# EAGLE design tira rev4 (EAGLE 8.5.1)
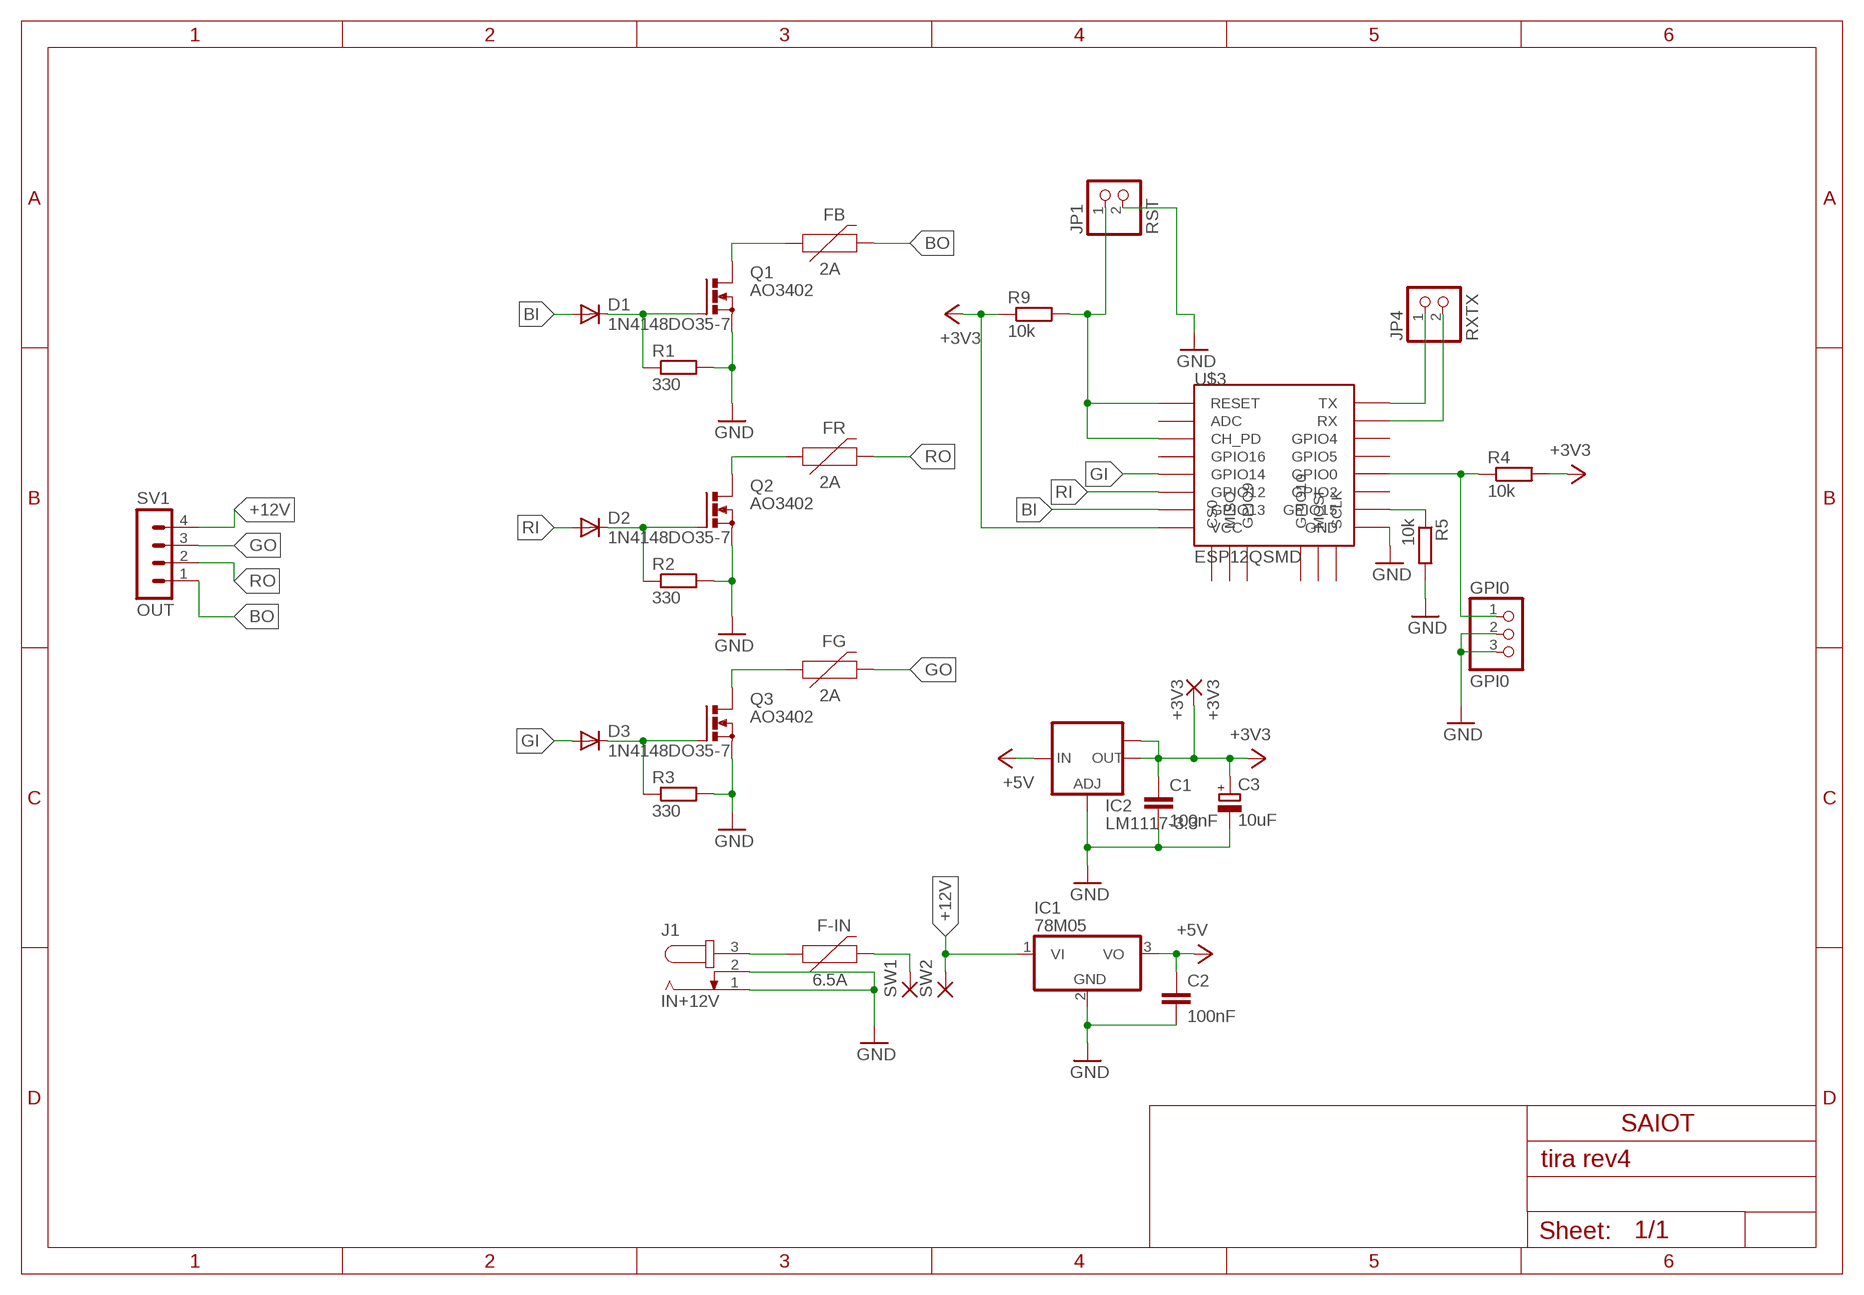
[diagram p0: schematic, sheet 1]

## Parts
+3V3  +3V3  2,15/1,0  [2,15/1,0]
C1  100nF  C-EU050-024X044  [C050-024X044]
C2  100nF  C-EU050-024X044  [C050-024X044]
C3  10uF  CPOL-EUE2.5-7  [E2,5-7]
D1  1N4148DO35-7  [DO35-7]
D2  1N4148DO35-7  [DO35-7]
D3  1N4148DO35-7  [DO35-7]
F-IN  6.5A  PPTC_6V500MA  [0805]
FB  2A  PPTC_6V500MA  [0805]
FG  2A  PPTC_6V500MA  [0805]
FR  2A  PPTC_6V500MA  [0805]
GPI0  GPI0  PINHD-1X3  [1X03]
IC1  78M05  7805T  [TO220H]
IC2  LM1117-3.3  LM1117IMPX-ADJ  [SOT223]
J1  IN+12V  JACK-PLUG0  [SPC4077]
JP1  RST  PINHD-1X2  [1X02]
JP4  RXTX  PINHD-1X2  [1X02]
Q1  AO3402  IRLML6344  [SOT-23]
Q2  AO3402  IRLML6344  [SOT-23]
Q3  AO3402  IRLML6344  [SOT-23]
R1  330  R-EU_0204/7  [0204/7]
R2  330  R-EU_0204/7  [0204/7]
R3  330  R-EU_0204/7  [0204/7]
R4  10k  R-EU_0204/7  [0204/7]
R5  10k  R-EU_0204/7  [0204/7]
R9  10k  R-EU_0204/7  [0204/7]
SV1  OUT  MA04-1  [MA04-1]
SW1  1,6/0,8  [1,6/0,8]
SW2  1,6/0,8  [1,6/0,8]
U$3  ESP12QSMD  [ESP12QSMD]

## Nets
+3V3: +3V3.1(P) C1.1 C3.+ IC2.2(OUT) IC2.TAB(OUT1) R4.2 R9.1 U$3.VCC
+5V [+V]: C2.1 IC1.3(VO) IC2.3(IN)
+12V: IC1.1(VI) SV1.4 SW2.1(P)
BB: D1.C Q1.P1(G) R1.1
BG: D3.C Q3.P1(G) R3.1
BI: D1.A U$3.GPIO13
BO [+V]: FB.2 SV1.1
BOFUSE [+V]: FB.1 Q1.P3(D)
BR: D2.C Q2.P1(G) R2.1
GI: D3.A U$3.GPIO14
GND [GND]: C1.2 C2.2 C3.- GPI0.2 GPI0.3 IC1.2(GND) IC2.1(ADJ) J1.1 J1.2 JP1.2 Q1.P2(S) Q2.P2(S) Q3.P2(S) R1.2 R2.2 R3.2 R5.2 U$3.GND
GO [+V]: FG.2 SV1.3
GOFUSE [+V]: FG.1 Q3.P3(D)
GPIO15: R5.1 U$3.GPIO15
N$1: F-IN.2 SW1.1(P)
N$2: F-IN.1 J1.3
N$8: JP1.1 R9.2 U$3.CH_PD U$3.RESET
N$12: GPI0.1 R4.1 U$3.GPIO0
N$13: JP4.1 U$3.TX
N$14: JP4.2 U$3.RX
RI: D2.A U$3.GPIO12
RO [+V]: FR.2 SV1.2
ROFUSE [+V]: FR.1 Q2.P3(D)
Unconnected: U$3.ADC U$3.CS0 U$3.GPIO2 U$3.GPIO4 U$3.GPIO5 U$3.GPIO9 U$3.GPIO10 U$3.GPIO16 U$3.MISO U$3.MOSI U$3.SCLK

## Notes on the sheet
- SAIOT

## Library data of the parts
+3V3 = wirepad:2,15/1,0: THROUGH-HOLE PAD
C1 C2 = rcl:C-EU: CAPACITOR, European symbol; SPICEPREFIX: C
C3 = rcl:CPOL-EU: POLARIZED CAPACITOR, European symbol; SPICEPREFIX: C
D1-D3 = diode:1N4148: DIODE high speed (Philips)
F-IN FB FG FR = SparkFun-Fuses:PPTC: Resettable Fuse PPTC Resettable Fuse. Really a sort of resistor with a polymeric positive temperature coefficient whose resistance increases dramatically with an increase in temperature. When heated by the power passing through the resistance rises causing the current to be limited, protecting the circuit. This is achieved by the transition of the polymer from a crystalline to an amorphous state where the conductive carbon separates breaking the conductive pathways found in the cool crystalline structure. When a PPTC cools back down it resumes conducting letting the circuit turn back on. SparkFun Products: SparkFun RedBoard - Programmed with Arduino <https://www.sparkfun.com/products/12757> Pro Micro - 5V/16MHz <https://www.sparkfun.com/products/12640> Arduino Pro 328 - 5V/16MHz <https://www.sparkfun.com/products/10915> MP3 Trigger <https://www.sparkfun.com/products/13720>; PROD_ID: 13945; VALUE: 6V 0.5A
GPI0 = pinhead:PINHD-1X3: PIN HEADER
IC1 = linear:78*: Positive VOLTAGE REGULATOR Source: http://cache.national.com/ds/LM/LM78L05.pdf http://www.fairchildsemi.com/ds/LM/LM7805.pdf
IC2 = lm1117:LM1117IMPX-ADJ
J1 = con-jack:JACK-PLUG: DC POWER JACK Power Jack, DC, Right Angle, Through Hole, Rated 5A at 16VDC, PC Terminals Distributor: Farnell (www.Farnell.de) Drawing: 84N1161.pdf / 84N1162.pdf Manufacturer: SPC Technology (www.spctechnology.com) Type: SPC4077 / SPC 4078; OC_FARNELL: unknown; OC_NEWARK: unknown
JP1 JP4 = pinhead:PINHD-1X2: PIN HEADER
Q1-Q3 = mosfet:IRLML6344: Nch MOSFET IRLML6344 30V 5A http://akizukidenshi.com/catalog/g/gI-06049/ I-06049
R1-R5 R9 = rcl:R-EU_: RESISTOR, European symbol; SPICEPREFIX: R
SV1 = con-lstb:MA04-1: PIN HEADER; OC_FARNELL: unknown; OC_NEWARK: unknown
SW1 SW2 = wirepad:1,6/0,8: THROUGH-HOLE PAD
U$3 = esp826612qSMD:ESP12Q: ESP8266 Wifi module 12-Q

## Net classes
0 SIGNAL: width 0.61 mm, clearance 0.406 mm
1 GND: width 1.016 mm, clearance 0.406 mm
2 +V: width 1.016 mm, clearance 0.406 mm

## Board
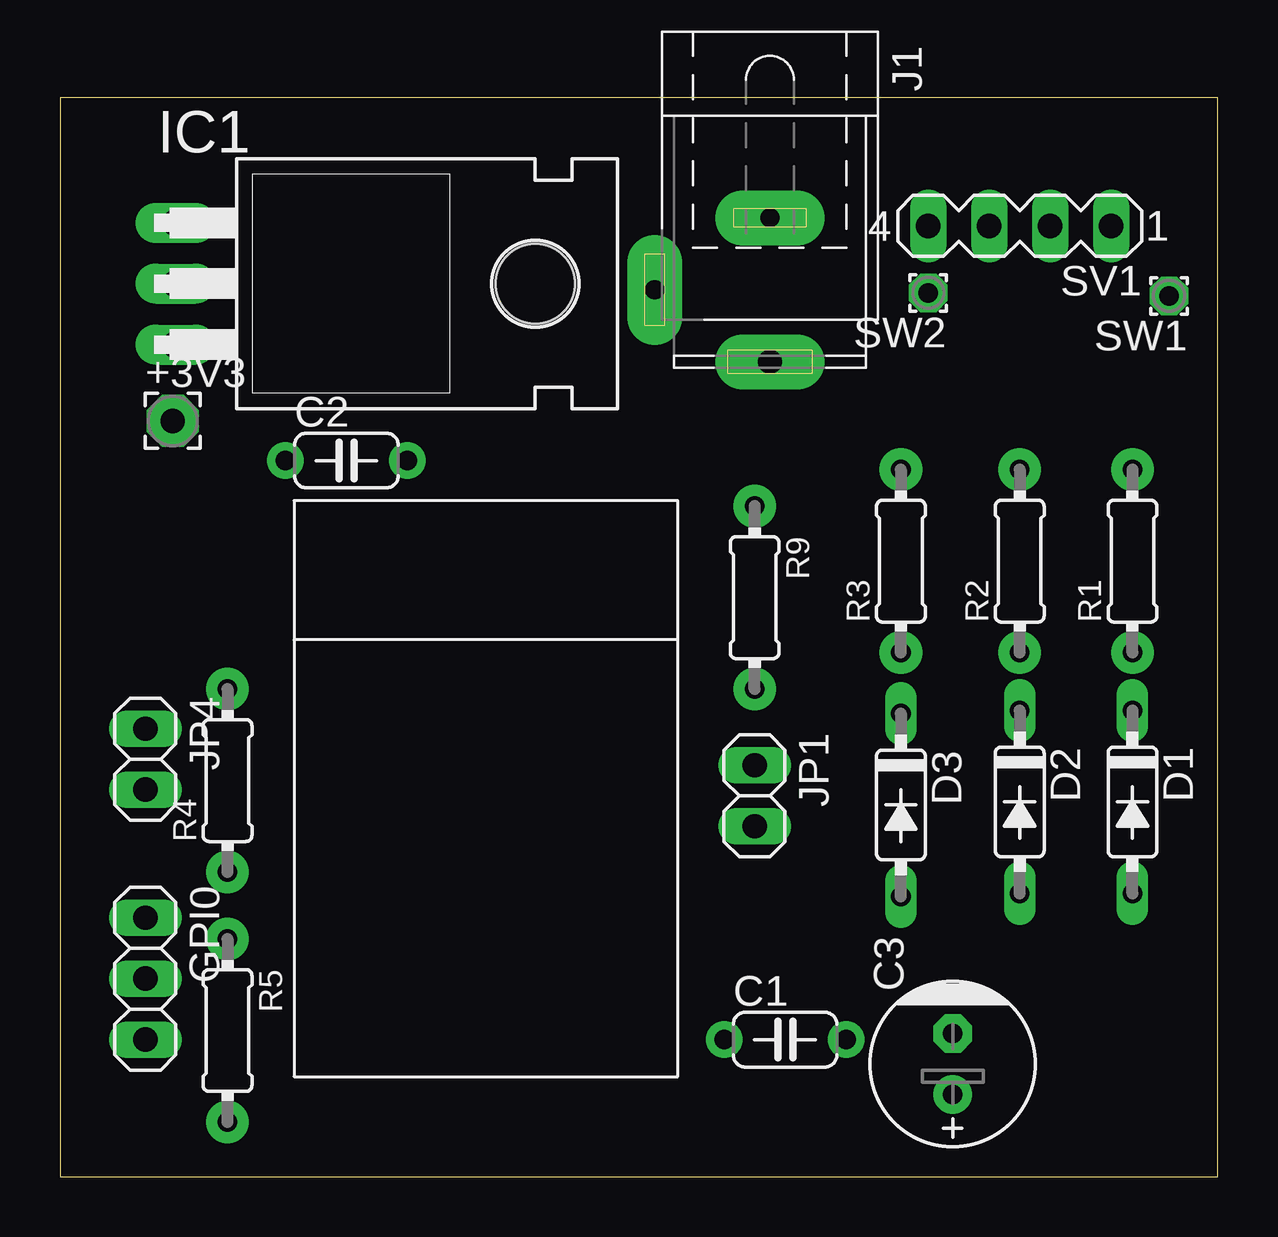
[diagram p1: board, top side]
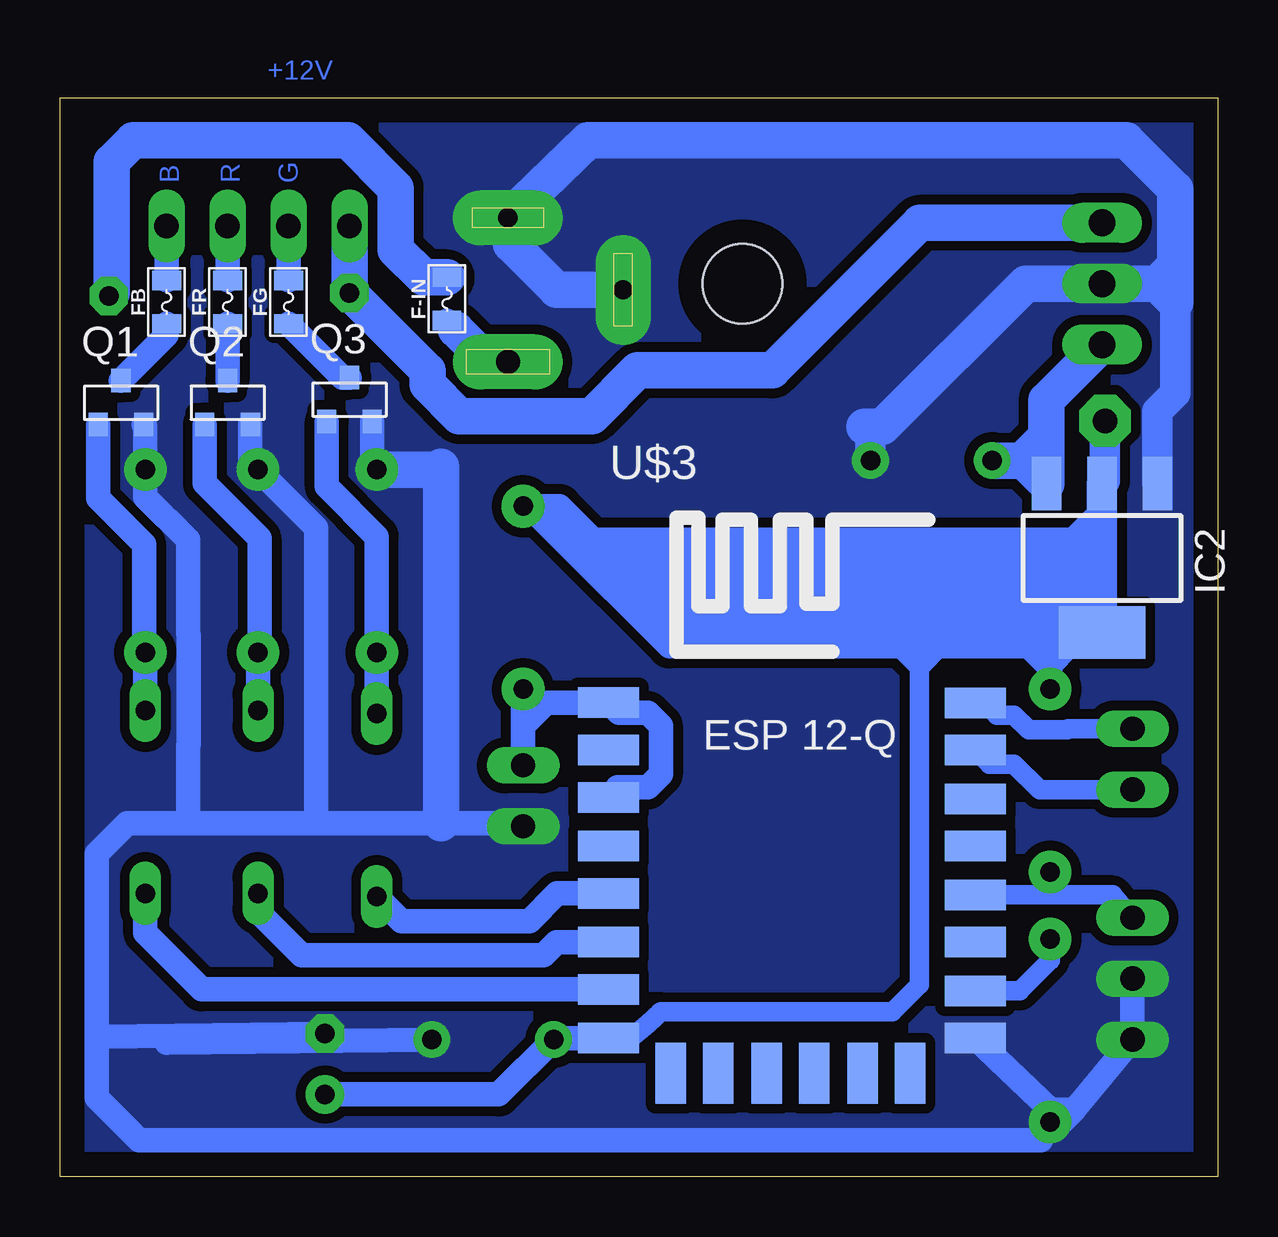
[diagram p2: board, bottom side, seen from below]

Size 48.26 x 44.96 mm. Coordinates in mm from the lower left corner, seen from the top.
Outline: 0,0 48.26,0 48.26,44.96 0,44.96 0,0
Copper layers (1*16): Top 0.035mm / dielectric 1.5mm / Bottom 0.035mm
Design rules "default": minimum track width 6mil, minimum drill 0.35mm, track to track 6mil, track to pad 6mil, pad to pad 6mil, via to via 6mil, smd to smd 6mil, copper to edge 40mil, drill to drill 6mil, minimum pad ring 10mil, minimum via ring 8mil, stop-mask expansion 4mil, vias tented up to drill 0mil, thermal gap 10mil

### Footprints (pad centres in the part's own frame; a part is rotated, then mirrored left to right if it is on the bottom)
2,15/1,0 = drill 1.016 pad 2.159 octagon: 1 0,0
C050-024X044 = drill 0.813 pad 1.524: 1 -2.54,0; 2 2.54,0
E2,5-7 = drill 0.813 pad 1.6: + -1.27,0 | drill 0.813 pad 1.6 octagon: - 1.27,0
DO35-7 = drill 0.813 long: A 3.81,0; C -3.81,0
0805 = smd 0.8 x 1.2: 1 -0.9,0; 2 0.9,0
1X03 = drill 1.016 long: 1 -2.54,0; 2 0,0; 3 2.54,0
TO220H = drill 1.118 long: 1 -2.54,-10.16; 2 0,-10.16; 3 2.54,-10.16 | hole 3.302: 0,4.826
SOT223 = smd 1.219 x 2.235: 1 -2.311,-3.099; 2 0,-3.099; 3 2.311,-3.099 | smd 3.6 x 2.2: TAB 0,3.099
SPC4077 = drill 0.8 pad 2.286 long: 1 -3,0; 2 0,-4.8 | drill 1 pad 2.286 long: 3 3,0
1X02 = drill 1.016 long: 1 -1.27,0; 2 1.27,0
SOT-23 = smd 0.802 x 0.972: P1 -0.95,-0.917; P2 0.95,-0.917; P3 0,0.917
0204/7 = drill 0.813 pad 1.778: 1 -3.81,0; 2 3.81,0
MA04-1 = drill 1.016 long: 1 -3.81,0; 2 -1.27,0; 3 1.27,0; 4 3.81,0
1,6/0,8 = drill 0.813 pad 1.6 octagon: 1 0,0
ESP12QSMD = smd 2.54 x 1.27: ADC -7.747,3.81; CH_PD -7.747,1.841; GND 7.556,-8.191; GPIO0 7.556,-2.223; GPIO2 7.556,-4.191; GPIO4 7.556,1.778; GPIO5 7.556,-0.191; GPIO12 -7.747,-4.191; GPIO13 -7.747,-6.16; GPIO14 -7.747,-2.159; GPIO15 7.556,-6.223; GPIO16 -7.747,-0.191; RESET -7.747,5.791; RX 7.556,3.81; TX 7.556,5.779; VCC -7.747,-8.191 | smd 1.27 x 2.54: CS0 -5.144,-9.652; GPIO9 -1.143,-9.652; GPIO10 0.826,-9.652; MISO -3.175,-9.652; MOSI 2.857,-9.652; SCLK 4.826,-9.652

### Placement (x,y rotation side)
+3V3  4.7,31.5 0 top
C1  30.23,5.71 0 top
C2  11.94,29.84 0 top
C3  37.21,4.7 90 top
D1  44.7,15.62 270 top
D2  40.01,15.62 270 top
D3  35.05,15.49 270 top
F-IN  32.13,36.58 90 bottom
FB  43.81,36.45 90 bottom
FG  38.73,36.45 90 bottom
FR  41.27,36.45 90 bottom
GPI0  3.56,8.26 270 top
IC1  14.99,37.21 270 top
IC2  4.83,25.78 180 bottom
J1  29.59,36.96 270 top
JP1  28.96,15.88 270 top
JP4  3.56,17.4 270 top
Q1  45.72,32.26 0 bottom
Q2  41.27,32.26 0 bottom
Q3  36.2,32.38 0 bottom
R1  44.7,25.65 90 top
R2  40.01,25.65 90 top
R3  35.05,25.65 90 top
R4  6.99,16.51 90 top
R5  6.99,6.1 270 top
R9  28.96,24.13 270 top
SV1  40.01,39.62 180 top
SW1  46.23,36.7 180 top
SW2  36.2,36.83 180 top
U$3  17.65,13.97 0 bottom

### Tracks (layer width: path | path; a pad name or v marks a point on that pad's centre or on a via)
+3V3
  Bottom 0.813: 4.88,22.73 IC2.TAB | 24.77,5.84 25.34,5.84 U$3.VCC 24.48,5.78 23.76,6.38 23.22,6.88 | 23.22,6.88 23.24,6.86 | 5.33,22.68 6.48,22.68 6.99,22.68 9.83,22.68 | 13.46,22.61 23.37,22.61 27.43,26.67 | 23.22,6.88 13.56,6.88 12.45,8 12.45,21.21 | 13.08,22.1 13.34,22.1 12.45,21.21 | 12.45,21.21 12.45,22.1 | 12.45,21.21 11.56,22.1 11.05,22.1 | 12.19,22.73 12.83,23.37
  Bottom 1.016: U$3.VCC 27.62,5.78 C1.1 29.97,3.43 C3.+ | 5.33,22.68 IC2.TAB 5.41,22.1 6.22,22.1 | 6.22,22.1 7.87,22.1 | 7.87,22.1 11.05,22.1 12.45,22.1 13.34,22.1 22.86,22.1 27.43,26.67 28.7,27.94 | 6.22,22.43 6.48,22.68 | 6.99,21.34 6.99,22.68 | R4.2 6.99,21.34 | 6.99,21.34 6.22,22.1 | 6.99,21.34 7.11,21.34 7.87,22.1 | 28.7,27.94 R9.1 | 25.91,26.42 27.43,27.94 28.7,27.94
  Bottom 1.27: IC2.2 4.83,22.78 | IC2.2 4.83,27.56 5.97,26.42 25.91,26.42 | +3V3.1 4.7,29.01 IC2.2
  Bottom 1.524: 4.83,22.78 4.88,22.73 | IC2.TAB 5.84,23.7 5.84,25.4 24.89,25.4 | 25.4,25.4 24.89,25.4 | 24.89,25.4 22.86,23.37 12.83,23.37 11.05,23.37 | 22.86,24.38 20.57,24.38 20.32,24.13 6.86,24.13 6.99,24 6.99,23.37 11.05,23.37 | 11.05,23.37 11.05,22.61 | 12.57,22.73 12.19,22.73
+5V
  Bottom 1.524: IC1.3 7.14,32.36 7.14,30.86 | 7.14,30.86 7.14,29.72 | 7.14,29.72 IC2.3 8.1,29.84 | C2.1 8.13,29.84 | 8.1,29.84 7.26,29.84 7.14,29.72 | 8.13,29.84 8.1,29.84 | 8.13,29.84 8.13,29.87 7.14,30.86
+12V
  Bottom 1.524: IC1.1 12.42,39.75 18.57,33.6 24.18,33.6 26.09,31.7 31.62,31.7 32.94,33.02 32.94,33.58 SW2.1 SV1.4
BB
  Bottom 1.016: D1.C R1.1 44.76,21.9 44.76,26.36 46.67,28.27 Q1.P1
BG
  Bottom 1.016: D3.C R3.1 35.05,26.67 37.15,28.76 Q3.P1
BI
  Bottom 1.016: U$3.GPIO13 42.35,7.81 44.7,10.16 D1.A
BO
  Bottom 1.016: FB.2 SV1.1
BOFUSE
  Bottom 1.016: FB.1 43.81,35.08 Q1.P3
BR
  Bottom 1.016: D2.C R2.1 39.94,21.91 39.94,26.6 42.23,28.89 Q2.P1
GI
  Bottom 0.813: 26.67,11.81 U$3.GPIO14
  Bottom 1.016: D3.A 34.02,10.65 28.69,10.65 27.54,11.81 26.67,11.81
GND
  Bottom 1.016: Q1.P2 44.7,31.27 R1.2 44.7,28.32 42.93,26.54 42.93,22.62 42.9,22.59 42.9,18.01 42.93,17.98 42.93,14.73 | Q2.P2 40.33,29.78 R2.2 37.59,27.05 37.59,14.73 | Q3.P2 35.24,29.66 R3.2 | 37.59,14.73 32.38,14.73 28.45,14.73 JP1.2 | C2.2 14.48,30.73 13.97,31.24 | 42.93,14.73 45.47,14.73 46.74,13.46 46.74,5.71 | 42.93,14.73 37.59,14.73 | 46.74,5.71 46.74,3.3 44.96,1.52 7.37,1.52 R5.2 6.6,2.16 5.97,2.79 | C1.2 43.81,5.59 C3.- 46.61,5.84 46.74,5.71 | GPI0.2 GPI0.3 5.97,2.79 | U$3.GND 6.99,2.79 5.97,2.79
  Bottom 1.27: IC2.1 2.52,31.9 1.78,32.64 1.78,36.45 | C2.2 14.48,30.99 14.73,31.24
  Bottom 1.524: 25.02,37.97 24.92,38.07 J1.2 27.56,36.96 29.46,38.86 J1.1 26.24,43.18 3.81,43.18 1.78,41.15 1.78,37.97 | 1.78,37.97 2.54,37.21 | 2.54,37.21 IC1.2 8,37.21 13.97,31.24 14.73,31.24 | 1.78,37.97 1.78,36.45 2.54,37.21 | 32.38,14.73 32.38,29.59 32.51,29.46 R3.2
  pour Bottom (no thermals): 0.13,48.77 51.44,48.51 51.31,-0.64 -0.13,-0.51
GO
  Bottom 1.016: FG.2 SV1.3
GOFUSE
  Bottom 1.016: FG.1 36.49,33.3 Q3.P3
GPIO15
  Bottom 0.813: U$3.GPIO15 8.26,7.75 6.99,9.02 R5.1
N$1
  Bottom 1.016: 46.1,36.83 SW1.1
  Bottom 1.524: 46.1,36.83 46.1,42.29 45.21,43.18 36.26,43.18 34.27,41.19 34.27,38.63 33.11,37.48 F-IN.2
N$2
  Bottom 1.016: 31.76,35.3 F-IN.1
  Bottom 1.524: J1.3 30.41,33.96 31.76,35.3
N$8
  Bottom 1.016: U$3.CH_PD 25.02,16.19 25.02,16.23 23.75,16.23 23.22,16.77 23.22,18.79 23.75,19.33 24.97,19.33 U$3.RESET 27.81,19.76 27.99,19.76 | 27.99,19.76 28.4,19.76 R9.2 28.96,18.8 | JP1.1 28.96,18.8 | 28.96,18.8 27.99,19.76
N$12
  Bottom 0.61: 9.93,11.52 U$3.GPIO0
  Bottom 0.813: GPI0.1 4.38,11.75 7.11,11.75 | 7.11,11.75 U$3.GPIO0 | R4.1 6.99,11.87 7.11,11.75
N$13
  Bottom 0.61: 9.93,19.94 U$3.TX
  Bottom 0.813: JP4.1 6.23,18.67 6.28,18.62 7.88,18.62 8.49,19.23 9.21,19.23 9.93,19.94
N$14
  Bottom 0.813: U$3.RX 9.51,17.2 8.49,17.2 7.42,16.13 JP4.2
RI
  Bottom 1.016: U$3.GPIO12 27.56,9.78 28.11,9.23 38.19,9.23 40.01,11.05 D2.A
RO
  Bottom 1.016: FR.2 SV1.2
ROFUSE
  Bottom 1.016: FR.1 Q2.P3

### Text on the board
Bottom: +12V | G | R | B